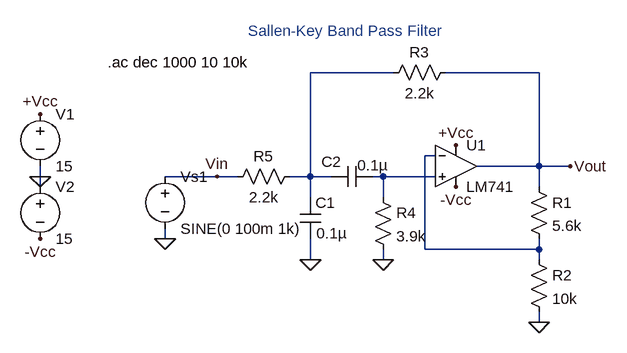
[diagram p0: schematic 2017B5A30983P.asc]
2017B5A30983P.asc, the LTspice schematic file:
Version 4
SHEET 1 880 680
WIRE 32 16 -96 16
WIRE 256 16 112 16
WIRE 96 144 80 144
WIRE 256 160 256 16
WIRE 256 160 160 160
WIRE 304 160 256 160
WIRE -512 176 -512 160
WIRE -240 176 -320 176
WIRE -208 176 -240 176
WIRE -96 176 -96 16
WIRE -96 176 -128 176
WIRE -64 176 -96 176
WIRE 16 176 0 176
WIRE 96 176 16 176
WIRE -512 192 -512 176
WIRE 256 192 256 160
WIRE -96 208 -96 176
WIRE 16 208 16 176
WIRE -320 272 -320 256
WIRE 80 288 80 144
WIRE 256 288 256 272
WIRE 256 288 80 288
WIRE -96 304 -96 272
WIRE 16 304 16 288
WIRE 256 304 256 288
WIRE 256 400 256 384
FLAG -512 176 0
FLAG -512 80 +Vcc
FLAG -512 272 -Vcc
FLAG 128 192 -Vcc
FLAG 128 128 +Vcc
FLAG 256 400 0
FLAG -320 272 0
FLAG 304 160 Vout
FLAG 16 304 0
FLAG -96 304 0
FLAG -240 176 Vin
SYMBOL Opamps\\LM741 128 96 R0
SYMATTR InstName U1
SYMBOL voltage -512 64 R0
SYMATTR InstName V1
SYMATTR Value 15
SYMBOL voltage -512 176 R0
SYMATTR InstName V2
SYMATTR Value 15
SYMBOL res 240 176 R0
SYMATTR InstName R1
SYMATTR Value 5.6k
SYMBOL res 240 288 R0
SYMATTR InstName R2
SYMATTR Value 10k
SYMBOL voltage -320 160 R0
WINDOW 39 0 0 Left 2
SYMATTR InstName Vs1
SYMATTR Value SINE(0 100m 1k)
SYMATTR Value2 AC 100m 0
SYMBOL res 128 0 R90
WINDOW 0 0 56 VBottom 2
WINDOW 3 32 56 VTop 2
SYMATTR InstName R3
SYMATTR Value 2.2k
SYMBOL res 0 192 R0
SYMATTR InstName R4
SYMATTR Value 3.9k
SYMBOL cap -112 208 R0
WINDOW 3 25 55 Left 2
SYMATTR Value 0.1µ
SYMATTR InstName C1
SYMBOL cap 0 160 R90
WINDOW 0 9 64 VBottom 2
WINDOW 3 -17 0 VTop 2
SYMATTR InstName C2
SYMATTR Value 0.1µ
SYMBOL res -112 160 R90
WINDOW 0 0 56 VBottom 2
WINDOW 3 32 56 VTop 2
SYMATTR InstName R5
SYMATTR Value 2.2k
TEXT -408 0 Left 2 !.ac dec 1000 10 10k
TEXT -192 -48 Left 2 ;Sallen-Key Band Pass Filter

The netlist it stands for:
* 2017B5A30983P.asc
XU1 N003 N002 +Vcc -Vcc Vout LM741  ; pins In+ In- V+ V- OUT
V1 +Vcc 0 15
V2 0 -Vcc 15
R1 Vout N002 5.6k
R2 N002 0 10k
Vs1 Vin 0 SINE(0 100m 1k) AC 100m 0
R3 Vout N001 2.2k
R4 N003 0 3.9k
C1 N001 0 0.1µ
C2 N003 N001 0.1µ
R5 N001 Vin 2.2k
.ac dec 1000 10 10k
* Sallen-Key Band Pass Filter
.lib LM741.lib
.backanno
.end